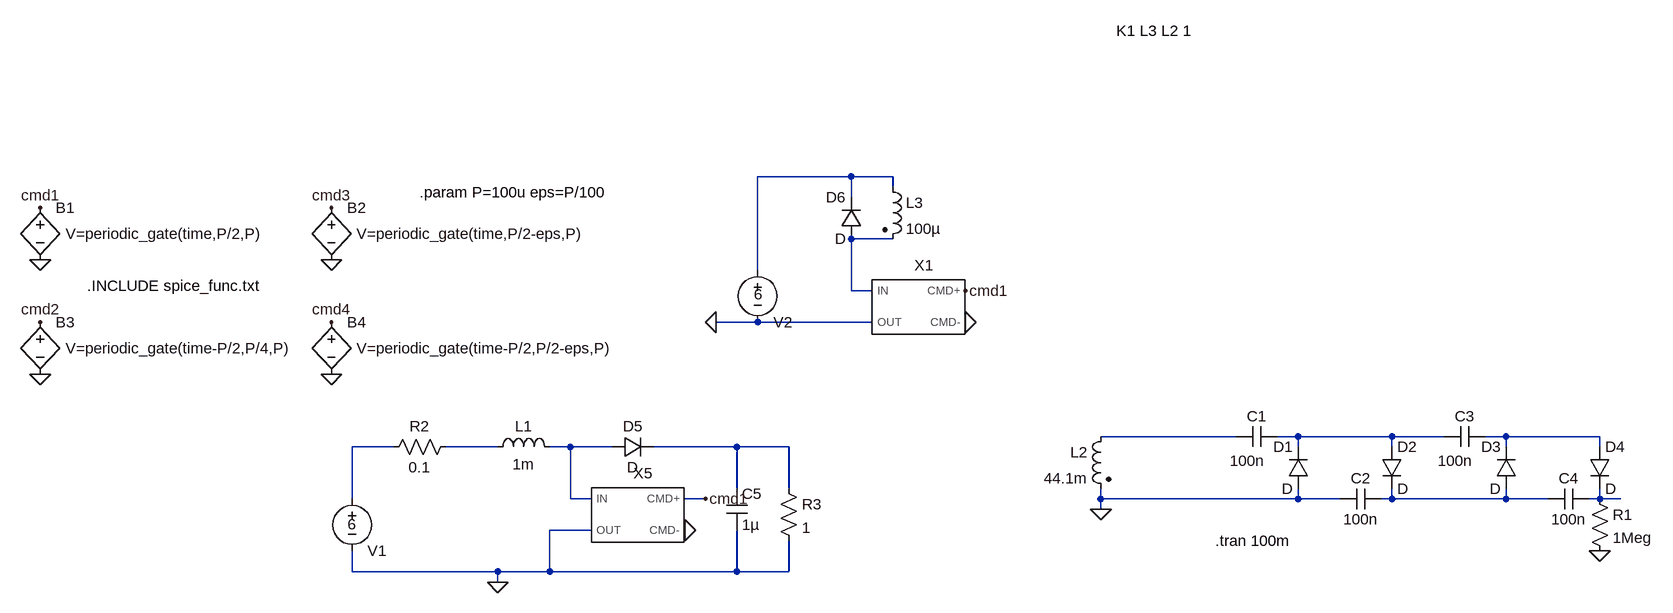
[diagram p0: schematic essai.asc]
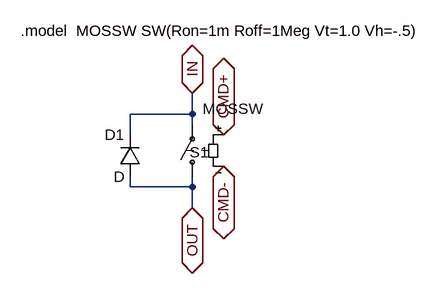
[diagram p1: sub-circuit switch-mos.asc]
essai.asc, the LTspice schematic file:
Version 4
SHEET 1 1080 680
WIRE -160 -400 -304 -400
WIRE -96 -400 -160 -400
WIRE -96 -384 -96 -400
WIRE -160 -368 -160 -400
WIRE -96 -304 -160 -304
WIRE -304 -256 -304 -400
WIRE -160 -224 -160 -304
WIRE -128 -224 -160 -224
WIRE -304 -176 -368 -176
WIRE -128 -176 -304 -176
WIRE 432 0 224 0
WIRE 528 0 496 0
WIRE 672 0 528 0
WIRE 752 0 672 0
WIRE 848 0 816 0
WIRE 992 0 848 0
WIRE -864 16 -928 16
WIRE -704 16 -784 16
WIRE -592 16 -624 16
WIRE -528 16 -592 16
WIRE -336 16 -464 16
WIRE -256 16 -336 16
WIRE 528 16 528 0
WIRE 672 16 672 0
WIRE 848 16 848 0
WIRE 992 16 992 0
WIRE -336 80 -336 16
WIRE -256 80 -256 16
WIRE -928 96 -928 16
WIRE -592 96 -592 16
WIRE -560 96 -592 96
WIRE -384 96 -416 96
WIRE 224 96 224 80
WIRE 528 96 528 80
WIRE 528 96 224 96
WIRE 592 96 528 96
WIRE 672 96 672 80
WIRE 672 96 656 96
WIRE 848 96 848 80
WIRE 848 96 672 96
WIRE 912 96 848 96
WIRE 992 96 992 80
WIRE 992 96 976 96
WIRE 1024 96 992 96
WIRE 224 112 224 96
WIRE -560 144 -624 144
WIRE -928 208 -928 176
WIRE -704 208 -928 208
WIRE -624 208 -624 144
WIRE -624 208 -704 208
WIRE -336 208 -336 144
WIRE -336 208 -624 208
WIRE -256 208 -256 160
WIRE -256 208 -336 208
WIRE -704 224 -704 208
FLAG 224 112 0
FLAG 992 176 0
FLAG -1408 -272 0
FLAG -1408 -352 cmd1
FLAG -960 -272 0
FLAG -960 -352 cmd3
FLAG -1408 -96 0
FLAG -1408 -176 cmd2
FLAG -960 -96 0
FLAG -960 -176 cmd4
FLAG -384 96 cmd1
FLAG -704 224 0
FLAG -416 144 0
FLAG -368 -176 0
FLAG 16 -224 cmd1
FLAG 16 -176 0
SYMBOL cap 496 -16 R90
WINDOW 0 0 32 VBottom 2
WINDOW 3 38 46 VTop 2
SYMATTR InstName C1
SYMATTR Value 100n
SYMBOL cap 656 80 R90
WINDOW 0 0 32 VBottom 2
WINDOW 3 32 32 VTop 2
SYMATTR InstName C2
SYMATTR Value 100n
SYMBOL diode 544 80 R180
WINDOW 0 24 64 Left 2
WINDOW 3 24 0 Left 2
SYMATTR InstName D1
SYMBOL diode 656 16 R0
SYMATTR InstName D2
SYMBOL cap 816 -16 R90
WINDOW 0 0 32 VBottom 2
WINDOW 3 38 46 VTop 2
SYMATTR InstName C3
SYMATTR Value 100n
SYMBOL diode 864 80 R180
WINDOW 0 24 64 Left 2
WINDOW 3 24 0 Left 2
SYMATTR InstName D3
SYMBOL cap 976 80 R90
WINDOW 0 0 32 VBottom 2
WINDOW 3 32 32 VTop 2
SYMATTR InstName C4
SYMATTR Value 100n
SYMBOL diode 976 16 R0
SYMATTR InstName D4
SYMBOL res 976 80 R0
SYMATTR InstName R1
SYMATTR Value 1Meg
SYMBOL bv -1408 -368 R0
WINDOW 3 39 56 Left 2
SYMATTR Value V=periodic_gate(time,P/2,P)
SYMATTR InstName B1
SYMBOL bv -960 -368 R0
WINDOW 3 39 56 Left 2
SYMATTR Value V=periodic_gate(time,P/2-eps,P)
SYMATTR InstName B2
SYMBOL bv -1408 -192 R0
WINDOW 3 39 56 Left 2
SYMATTR Value V=periodic_gate(time-P/2,P/4,P)
SYMATTR InstName B3
SYMBOL bv -960 -192 R0
WINDOW 3 39 56 Left 2
SYMATTR Value V=periodic_gate(time-P/2,P/2-eps,P)
SYMATTR InstName B4
SYMBOL ind2 240 -16 M0
SYMATTR InstName L2
SYMATTR Value 44.1m
SYMATTR Type ind
SYMBOL switch-mos -480 144 M0
SYMATTR InstName X5
SYMBOL voltage -928 80 R0
WINDOW 0 24 96 Left 2
WINDOW 3 -7 55 Left 2
WINDOW 123 0 0 Left 2
WINDOW 39 -140 82 Left 2
SYMATTR InstName V1
SYMATTR Value 6
SYMBOL ind -720 32 R270
WINDOW 0 32 56 VTop 2
WINDOW 3 5 56 VBottom 2
SYMATTR InstName L1
SYMATTR Value 1m
SYMBOL res -768 0 R90
WINDOW 0 0 56 VBottom 2
WINDOW 3 32 56 VTop 2
SYMATTR InstName R2
SYMATTR Value 0.1
SYMBOL diode -528 32 R270
WINDOW 0 32 32 VTop 2
WINDOW 3 0 32 VBottom 2
SYMATTR InstName D5
SYMBOL cap -352 80 R0
SYMATTR InstName C5
SYMATTR Value 1µ
SYMBOL res -272 64 R0
SYMATTR InstName R3
SYMATTR Value 1
SYMBOL ind2 -112 -400 R0
SYMATTR InstName L3
SYMATTR Value 100µ
SYMATTR Type ind
SYMBOL diode -144 -304 R180
WINDOW 0 24 64 Left 2
WINDOW 3 24 0 Left 2
SYMATTR InstName D6
SYMBOL switch-mos -48 -176 M0
SYMATTR InstName X1
SYMBOL voltage -304 -272 R0
WINDOW 0 24 96 Left 2
WINDOW 3 -6 53 Left 2
WINDOW 123 0 0 Left 2
WINDOW 39 -140 82 Left 2
SYMATTR InstName V2
SYMATTR Value 6
TEXT 400 160 Left 2 !.tran 100m
TEXT -1336 -232 Left 2 !.INCLUDE spice_func.txt
TEXT -824 -376 Left 2 !.param P=100u eps=P/100
TEXT 248 -624 Left 2 !K1 L3 L2 1

switch-mos.asc, the sub-circuit schematic file:
Version 4
SHEET 1 880 680
WIRE 160 112 160 80
WIRE 160 112 64 112
WIRE 160 128 160 112
WIRE 64 144 64 112
WIRE 64 224 64 208
WIRE 160 224 160 208
WIRE 160 224 64 224
WIRE 160 256 160 224
FLAG 208 144 CMD+
IOPIN 208 144 BiDir
FLAG 208 192 CMD-
IOPIN 208 192 BiDir
FLAG 160 80 IN
IOPIN 160 80 BiDir
FLAG 160 256 OUT
IOPIN 160 256 BiDir
SYMBOL sw 160 224 R180
WINDOW 0 -25 53 Left 2
WINDOW 3 -109 120 Left 2
SYMATTR InstName S1
SYMATTR Value MOSSW
SYMBOL diode 80 208 R180
WINDOW 0 24 64 Left 2
WINDOW 3 24 0 Left 2
SYMATTR InstName D1
TEXT -104 -16 Left 2 !.model  MOSSW SW(Ron=1m Roff=1Meg Vt=1.0 Vh=-.5)

The netlist it stands for:
* essai.asc
C1 N004 N003 100n
C2 N010 0 100n
D1 0 N004 D
D2 N004 N010 D
C3 N005 N004 100n
D3 N010 N005 D
C4 N011 N010 100n
D4 N005 N011 D
R1 N011 0 1Meg
B1 cmd1 0 V=periodic_gate(time,P/2,P)
B2 cmd3 0 V=periodic_gate(time,P/2-eps,P)
B3 cmd2 0 V=periodic_gate(time-P/2,P/4,P)
B4 cmd4 0 V=periodic_gate(time-P/2,P/2-eps,P)
L2 N003 0 44.1m
XX5 cmd1 0 N008 0 switch-mos
V1 N006 0 6
L1 N007 N008 1m
R2 N007 N006 0.1
D5 N008 N009 D
C5 N009 0 1µ
R3 N009 0 1
L3 N001 N002 100µ
D6 N002 N001 D
XX1 cmd1 0 N002 0 switch-mos
V2 N001 0 6

* block symbol definitions
.subckt switch-mos CMD+ CMD- IN OUT
S1 OUT IN CMD+ CMD- MOSSW
D1 OUT IN D
.model  MOSSW SW(Ron=1m Roff=1Meg Vt=1.0 Vh=-.5)
.ends switch-mos

.model D D
.lib standard.dio
.tran 100m
.INCLUDE spice_func.txt
.param P=100u eps=P/100
K1 L3 L2 1
.backanno
.end